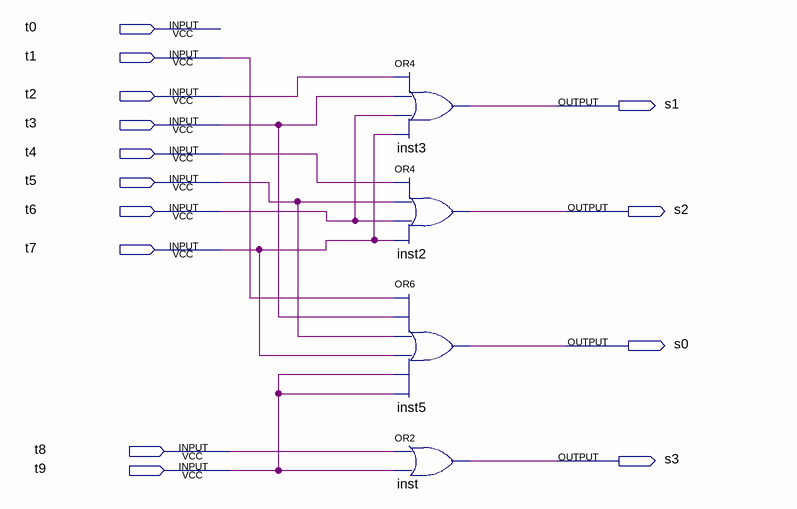
[diagram p0: schematic sheet]
// Quartus schematic codTecladoBlock.bdf as structural Verilog: 4 symbols, 14 pins
module codTecladoBlock (
  input  t0,
  input  t1,
  input  t2,
  input  t3,
  input  t4,
  input  t5,
  input  t6,
  input  t7,
  input  t8,
  input  t9,
  output s1,
  output s2,
  output s0,
  output s3
);

  or inst3 (s1, t2, t3, t6, t7);
  or inst2 (s2, t4, t5, t6, t7);
  or inst5 (s0, t1, t3, t5, t7, t9, t9);
  or inst (s3, t8, t9);
endmodule
